# Altium project Remote_Control.PrjPcb
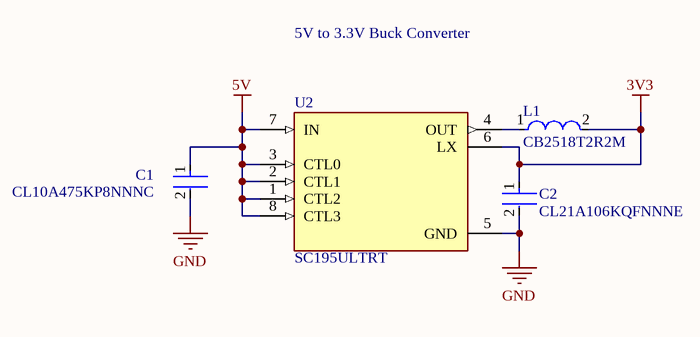
[diagram p0: Power.SchDoc]
3 sheets, 25 parts. Net scope: global (net labels, ports and power ports of the same name join across sheets).
Board file: MainBoard.PcbDoc
Sheets:
  Power.SchDoc
  USB.SchDoc
  Microcontroller.SchDoc

## Sheet Power.SchDoc
size A; SheetNumber: 1; SheetTotal: 3

### Parts
C1  CL10A475KP8NNNC  [FP-CL10-IPC_C]
C2  CL21A106KQFNNNE  [FP-CL21-IPC_A]
L1  CB2518T2R2M  [FP-CB2518-IPC_C]
U2  SC195ULTRT  [QFN40P150X150X60-8N]

### Nets
3V3: C2.1 L1.2 U2.6(LX)
5V: C1.1 U2.1(CTL2) U2.2(CTL1) U2.3(CTL0) U2.7(IN) U2.8(CTL3)
GND: C1.2 C2.2 U2.5(GND)
NetL1_1: L1.1 U2.4(OUT)

### Notes on the sheet
- 5V to 3.3V Buck Converter

### Library data of the parts
C1 = CMP-13271-003017-1: Cap Ceramic 4.7uF 10V X5R ±10% Pad SMD 0603 +85°C T/R; Capacitance: 4.7uF; Case/Package: 0603; Packaging: Tape and Reel; Width: 0.031inch; Contact Plating: Tin; Thickness: 0.035inch; Package Quantity: 1; Voltage Rating: 10V; Case Code (Metric): 1608; Case Code (Imperial): 0603; Depth: 0.8mm; Height: 0.8mm; Tolerance: 10%; Max Operating Temperature: 85°C; Length: 1.6mm; Dielectric: X5R; Mount: Surface Mount; Radiation Hardening: No; Min Operating Temperature: -55°C
C2 = CMP-13271-001826-1: CL21 Series 0805 10uF 6.3V ±10% Tolerance X5R Multilayer Ceramic Chip Capacitor; Voltage Rating (DC): 6.3V; Thickness: 0.053inch; Min Operating Temperature: -55°C; Mount: Surface Mount; Max Operating Temperature: 85°C; Case Code (Metric): 2012; Dielectric: X5R; Length: 2mm; Case Code (Imperial): 0805; Radiation Hardening: No; Height: 1.25mm; Depth: 1.25mm; Contact Plating: Tin; Voltage Rating: 6.3V; Width: 0.049inch; Package Quantity: 1; Capacitance: 10uF; Packaging: Tape and Reel; Tolerance: 10%; Lead Free: Lead Free; Case/Package: 0805
L1 = CMP-14484-000089-1: SMD Inductors 2.2uH ±20% 1.3A 0.117Ω 1007; Self Resonant Frequency: 68MHz; DC Resistance (DCR): 117mR; Core Material: Ferrite; Saturation Current: 510mA; Test Frequency: 7.96MHz; Shielding: Unshielded; Width: 0.071inch; Max Operating Temperature: 105°C; Tolerance: 20%; Halogen Free: Halogen Free; Length: 0.098inch; Height: 1.8mm; Case Code (Imperial): 1007; Package Quantity: 2000; Inductance: 2.2uH; Case/Package: 1007; Case Code (Metric): 2518; Current Rating: 1.3A; Packaging: Tape and Reel; Depth: 2mm; Mount: Surface Mount; Number of Pins: 2; Series: CB; Radiation Hardening: No; Height - Seated (Max): 0.079inch; Lead Free: Lead Free; Min Operating Temperature: -40°C; Termination: SMD/SMT; Resistor Type: Wirewound; Max DC Current: 510mA
U2 = SC195ULTRT: Buck Switching Regulator IC Positive Programmable 0.8V 1 Output 500mA 8-UFQFN; MF: {'manufacturer': u'Semtech Corporation'}; Value: *; Package: None; MP: SC195ULTRT; Price: None; Availability: Unavailable

## Sheet USB.SchDoc
size A; SheetNumber: 2; SheetTotal: 3
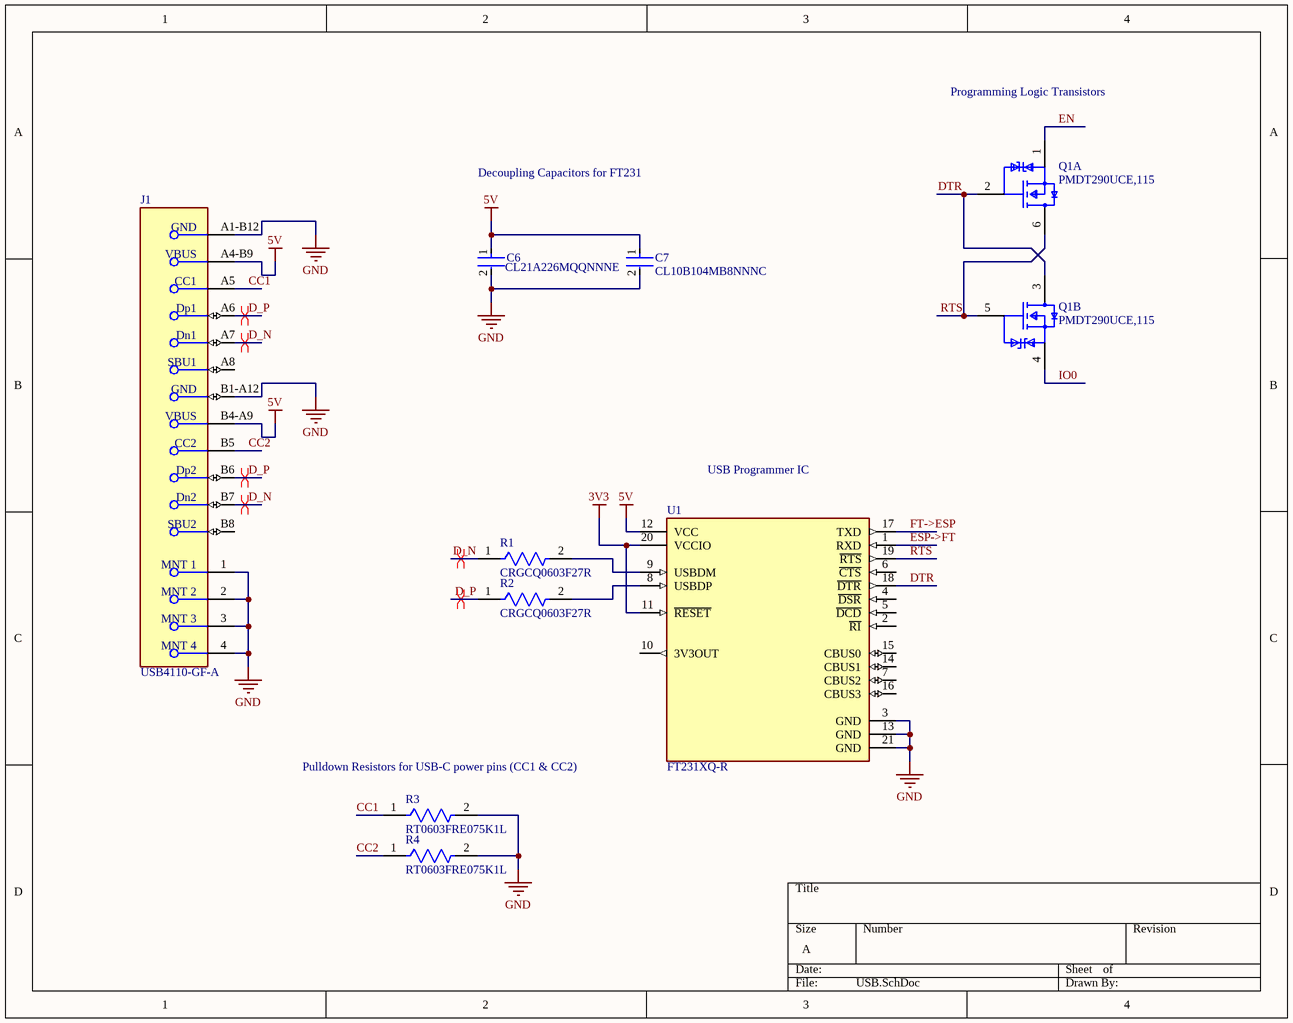
[diagram p1: USB.SchDoc]

### Parts
C6  CL21A226MQQNNNE  [FP-CL21-IPC_A]
C7  CL10B104MB8NNNC  [FP-CL10-IPC_C]
J1  USB4110-GF-A  [FP-USB4110-GF-A-MFG]
Q1  PMDT290UCE,115  [FP-SOT666-MFG]  (parts A,B of 2)
R1  CRGCQ0603F27R  [FP-CRGCQ0603-IPC_C]
R2  CRGCQ0603F27R  [FP-CRGCQ0603-IPC_C]
R3  RT0603FRE075K1L  [FP-RT0603-MFG]
R4  RT0603FRE075K1L  [FP-RT0603-MFG]
U1  FT231XQ-R  [FP-QFN-20-MFG]

### Nets
3V3: U1.11(~{RESET}) U1.20(VCCIO)
5V: C6.1 C7.1 J1.A4-B9(VBUS) J1.B4-A9(VBUS) U1.12(VCC)
GND: C6.2 C7.2 J1.1(MNT_1) J1.2(MNT_2) J1.3(MNT_3) J1.4(MNT_4) J1.A1-B12(GND) J1.B1-A12(GND) R3.2 R4.2 U1.3(GND) U1.13(GND) U1.21(GND)
CC1: J1.A5(CC1) R3.1
CC2: J1.B5(CC2) R4.1
D_N: J1.A7(Dn1) J1.B7(Dn2) R1.1
D_P: J1.A6(Dp1) J1.B6(Dp2) R2.1
DTR: Q1.2(G1) Q1.3(D2) U1.18(~{DTR})
EN: Q1.1(S1)
ESP->FT: U1.1(RXD)
FT->ESP: U1.17(TXD)
IO0: Q1.4(S2)
RTS: Q1.5(G2) Q1.6(D1) U1.19(~{RTS})
NetR1_2: R1.2 U1.9(USBDM)
NetR2_2: R2.2 U1.8(USBDP)

Not connected (* = marked no-connect by the designer): J1 A8(SBU1) B8(SBU2); U1 2(~{RI}) 4(~{DSR}) 5(~{DCD}) 6(~{CTS}) 7(CBUS2) 10(3V3OUT) 14(CBUS1) 15(CBUS0) 16(CBUS3)

### Layout directives
differential pair: D_N, D_P

### Notes on the sheet
- Programming Logic Transistors
- Decoupling Capacitors for FT231
- USB Programmer IC
- Pulldown Resistors for USB-C power pins (CC1 & CC2)

### Library data of the parts
C6 = CMP-13271-000185-1: CL21 Series 0805 22uF 6.3V ±20% Tolerance X5R Multilayer Ceramic Chip Capacitor; Height: 1.25mm; Length: 2mm; Capacitance: 22uF; Mount: Surface Mount; Dielectric: X5R; Voltage Rating (DC): 6.3V; Case Code (Metric): 2012; Depth: 1.25mm; Max Operating Temperature: 85°C; Voltage Rating: 6.3V; Width: 0.049inch; Case/Package: 0805; Radiation Hardening: No; Thickness: 0.055inch; Packaging: Tape and Reel; Package Quantity: 2000; Lead Free: Lead Free; Contact Plating: Tin; Min Operating Temperature: -55°C; Case Code (Imperial): 0805; Tolerance: 20%
C7 = CMP-13271-001724-1: Cap Ceramic 100nF 50V X7R ±20% Pad SMD 0603 +125°C T/R; Mount: Surface Mount; Lead Free: Lead Free; Max Operating Temperature: 125°C; Voltage Rating: 50V; Case Code (Imperial): 0603; Capacitance: 100nF; Height: 0.8mm; Length: 1.6mm; Tolerance: 20%; Case Code (Metric): 1608; Thickness: 0.035inch; Depth: 0.8mm; Width: 0.031inch; Package Quantity: 1; Min Operating Temperature: -55°C; Case/Package: 0603; Radiation Hardening: No; Voltage Rating (DC): 50V; Dielectric: X7R; Packaging: Tape and Reel
J1 = CMP-245163-000002-1: CONN USB 2.0 TYPE-C R/A SMT; Manufacturer: GCT; Conn Orientation: Right Angle; Usb Standard: USB 2.0; Voltage Rating: 20V; Current Rating: 3/4.25/1.25/0.25A; Number Of Contacts: 16; Is Female: yes; Shielding: true; Standoff Height: 0.1mm; Octopart: https://octopart.com/usb4110-gf-a-gct-103941985; Temperature: -40°C to +85°C; RoHS: TRUE; Automotive: No; Contact Material: Gold,Nickel; Device Class L1: Connectors; Device Class L2: USB Connectors; Package: 0; Lead Free: Yes; ComponentLink2URL: https://gct.co/files/drawings/usb4110.pdf; Temperature Range High: +85°C; Temperature Range Low: -40°C; Height: 3.46mm; Manufacturer Part Number: USB4110-GF-A; ComponentLink2Description: Datasheet; Device Class L3: unset; Digikey Description: CONN USB 2.0 TYPE-C R/A SMT; Category: Conn
Q1 = CMP-14409-000021-1: MOSFET N/P-CH 20V SOT666
R1 R2 = CMP-03211-005286-1: CRGCQ 0603 27R 1%; Manufacturer: TE Connectivity; Value: 27Ω; Power Rating: 0.1W; Voltage Rating: 75V; Tolerance: 0.01; Temperature Coefficient: ±200ppm/°C; ComponentLink2URL: https://www.te.com/commerce/DocumentDelivery/DDEController?Action=showdoc&DocId=Data+Sheet%7F1773204-3%7F1%7Fpdf%7FEnglish%7FENG_DS_1773204-3_1.pdf%7F4-2176339-332; ComponentLink2Description: Datasheet; Height: 0.55mm; Composition: Thick Film; Device Class L3: Chip SMD Resistors; Ambient Temperature Range High: +70°C; Device Class L2: Resistors; Package: CRGCQ0603; Digikey Description: CRGCQ 0603 27R 1%; Resistance: 27Ω; RoHS: TRUE; Temperature: -55°C to +155°C; Series: CRGCQ; Manufacturer Part Number: CRGCQ0603F27R; Category: Res; Device Class L1: Passive Components; Octopart: https://octopart.com/crgcq0603f27r-te+connectivity-91018062; Temperature Range High: +155°C; Lead Free: Yes; Ipc Land Pattern Name: RESC16080X45; Temperature Range Low: -55°C
R3 R4 = CMP-2000-04778-2: RES SMD 5.1K OHM 1% 1/10W 0603; Manufacturer: Yageo; Value: 5.1KΩ; Temperature Coefficient: 50 ppm/°C; Power Rating: 0.1W; Voltage Rating: 75V; Tolerance: 0.01; Lead Free: Yes; Temperature Range High: +155°C; Package: RT0603; Resistance: 5.1KΩ; Series: RT; Footprint Url: http://www.yageo.com/exep/pages/download/literatures/PYu-R_Mount_10.pdf; Ipc Land Pattern Name: RESC16080X45; Mouser Description: Res Thin Film 0603 5.1K Ohm 1% 0.1W(1/10W) ±50ppm/C Epoxy Pad SMD T/R; Octopart: https://octopart.com/rt0603fre075k1l-yageo-1421390; ComponentLink2URL: http://www.yageo.com/documents/recent/PYu-RT_1-to-0.01_RoHS_L_9.pdf; Manufacturer Part Number: RT0603FRE075K1L; RoHS: TRUE; Device Class L3: Chip SMD Resistors; Digikey Description: RES SMD 5.1K OHM 1% 1/10W 0603; Temperature: -55°C to +155°C; Height: 0.55mm; Automotive: No; Device Class L1: Passive Components; Temperature Range Low: -55°C; Category: Res; Composition: Thin Film; ComponentLink2Description: Datasheet; Device Class L2: Resistors
U1 = CMP-0248-00001-3: IC USB SERIAL FULL UART 20QFN; Data Rate: 12Mbps; Operating Supply Current: 8mA; Min Supply Voltage: 2.97V; Max Supply Voltage: 5.5V; Number of Channels: 1; Min Operating Temperature: -40°C; Case/Package: QFN; Mount: Surface Mount; Number of Pins: 20; Interface: UART; Lead Free: Lead Free; Package Quantity: 5000; Weight: 0.004339oz; Packaging: Tape and Reel; Max Operating Temperature: 85°C

## Sheet Microcontroller.SchDoc
size A; SheetNumber: 3; SheetTotal: 3
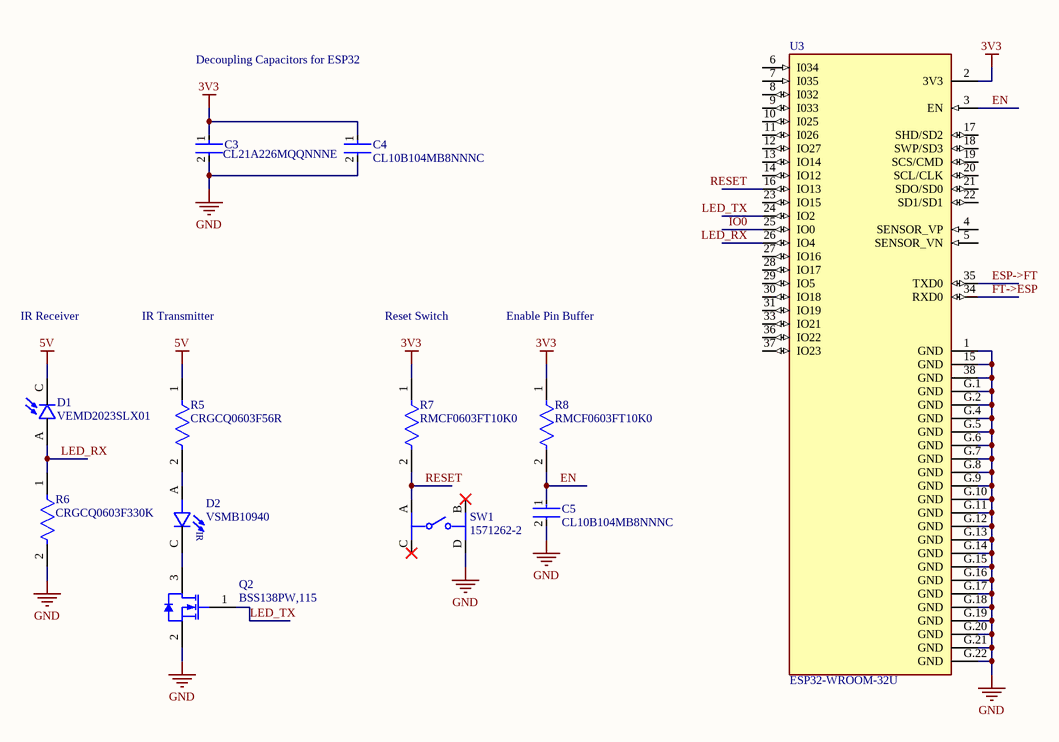
[diagram p2: Microcontroller.SchDoc]

### Parts
C3  CL21A226MQQNNNE  [FP-CL21-IPC_A]
C4  CL10B104MB8NNNC  [FP-CL10-IPC_C]
C5  CL10B104MB8NNNC  [FP-CL10-IPC_C]
D1  VEMD2023SLX01  [XDCR_VEMD2023SLX01]
D2  VSMB10940  [DIO_VSMB10940]
Q2  BSS138PW,115  [NXP-SOT323_M]
R5  CRGCQ0603F56R  [FP-CRGCQ0603-IPC_C]
R6  CRGCQ0603F330K  [FP-CRGCQ0603-IPC_C]
R7  RMCF0603FT10K0  [FP-RMCF0603-MFG]
R8  RMCF0603FT10K0  [FP-RMCF0603-MFG]
SW1  1571262-2  [FP-1571262-2-MFG]
U3  ESP32-WROOM-32U  [XCVR_ESP32-WROOM-32U]

### Nets
3V3: C3.1 C4.1 R7.1 R8.1 U3.2(3V3)
5V: D1.C R5.1
GND: C3.2 C4.2 C5.2 Q2.2(S) R6.2 SW1.D U3.1(GND) U3.15(GND) U3.38(GND) U3.G.1(GND) U3.G.2(GND) U3.G.4(GND) U3.G.5(GND) U3.G.6(GND) U3.G.7(GND) U3.G.8(GND) U3.G.9(GND) U3.G.10(GND) U3.G.11(GND) U3.G.12(GND) U3.G.13(GND) U3.G.14(GND) U3.G.15(GND) U3.G.16(GND) U3.G.17(GND) U3.G.18(GND) U3.G.19(GND) U3.G.20(GND) U3.G.21(GND) U3.G.22(GND)
EN: C5.1 R8.2 U3.3(EN)
ESP->FT: U3.35(TXD0)
FT->ESP: U3.34(RXD0)
IO0: U3.25(IO0)
LED_RX: D1.A R6.1 U3.26(IO4)
LED_TX: Q2.1(G) U3.24(IO2)
RESET: R7.2 SW1.A U3.16(IO13)
NetD2_A: D2.A R5.2
NetD2_C: D2.C Q2.3(D)

Not connected (* = marked no-connect by the designer): SW1 B* C*; U3 4(SENSOR_VP) 5(SENSOR_VN) 6(I034) 7(I035) 8(I032) 9(I033) 10(I025) 11(I026) 12(IO27) 13(IO14) 14(IO12) 17(SHD/SD2) 18(SWP/SD3) 19(SCS/CMD) 20(SCL/CLK) 21(SDO/SD0) 22(SD1/SD1) 23(IO15) 27(IO16) 28(IO17) 29(IO5) 30(IO18) 31(IO19) 33(IO21) 36(IO22) 37(IO23)

### Notes on the sheet
- Decoupling Capacitors for ESP32
- IR Receiver
- IR Transmitter
- Reset Switch
- Enable Pin Buffer
- (in symbol VSMB10940) IR

### Library data of the parts
C3 = CMP-13271-000185-1: as C6 on sheet USB; Height: 1.25mm; Length: 2mm; Capacitance: 22uF; Mount: Surface Mount; Dielectric: X5R; Voltage Rating (DC): 6.3V; Case Code (Metric): 2012; Depth: 1.25mm; Max Operating Temperature: 85°C; Voltage Rating: 6.3V; Width: 0.049inch; Case/Package: 0805; Radiation Hardening: No; Thickness: 0.055inch; Packaging: Tape and Reel; Package Quantity: 2000; Lead Free: Lead Free; Contact Plating: Tin; Min Operating Temperature: -55°C; Case Code (Imperial): 0805; Tolerance: 20%
C4 C5 = CMP-13271-001724-1: as C7 on sheet USB; Mount: Surface Mount; Lead Free: Lead Free; Max Operating Temperature: 125°C; Voltage Rating: 50V; Case Code (Imperial): 0603; Capacitance: 100nF; Height: 0.8mm; Length: 1.6mm; Tolerance: 20%; Case Code (Metric): 1608; Thickness: 0.035inch; Depth: 0.8mm; Width: 0.031inch; Package Quantity: 1; Min Operating Temperature: -55°C; Case/Package: 0603; Radiation Hardening: No; Voltage Rating (DC): 50V; Dielectric: X7R; Packaging: Tape and Reel
D1 = VEMD2023SLX01: MF: {'manufacturer': u'Vishay Semiconductor'}; Value: *; Package: None; MP: VEMD2023SLX01; Price: None; Availability: Unavailable
D2 = VSMB10940: 940 nm 65 mA Â±75Â° Surface Mount High Speed Infrared Emitting Diode; MF: {'manufacturer': u'Vishay Semiconductor'}; Value: *; Package: None; MP: VSMB10940; Price: None; Availability: Unavailable
Q2 = CMP-1259-00109-1: N-Channel Trench MOSFET, 60 V, 0.32 A, -55 to 150 degC, 3-Pin SOT323, Tape and Reel; Manufacturer: NXP Semiconductors; IDM [max] (A): 1.2; ID [max] (A): 0.32; Automotive Qualified: Y; Channel Type: N; VDS [max] (V): 60; Packing: Tape & Reel; DatasheetVersion: Rev. 1; PartNumber: BSS138PW,115; ComponentLink2URL: http://www.nxp.com/documents/data_sheet/BSS138PW.pdf; ComponentLink3Description: Package Specification; PackageReference: SOT323; PackageDescription: 3-Pin Small Outline Transistor Package, Body 2 x 1.25 mm, Pitch 0.65 mm; Code_JEITA: SC-70; ComponentLink3URL: http://www.nxp.com/documents/outline_drawing/sot323_po.pdf; ComponentLink1URL: http://www.nxp.com/; ComponentLink2Description: Datasheet; PackageVersion: 06-03-16, 03/2006; Mounting Technology: Surface Mount; ComponentLink1Description: Manufacturer URL; VGSth [typ] (V): 1.2
R5 = CMP-03211-009681-1: CRGCQ0603 56Ω 1% ±200ppm/°C 75V; Manufacturer: TE Connectivity; Tolerance: 0.01; Power Rating: 0.1W; Temperature Coefficient: ±200ppm/°C; Package: CRGCQ0603; Value: 56Ω; Temperature Range Low: -55°C; Composition: Thick Film; Series: CRGCQ; ComponentLink2Description: Datasheet; ComponentLink2URL: https://www.te.com/commerce/DocumentDelivery/DDEController?Action=showdoc&DocId=Data+Sheet%7F1773204-3%7F1%7Fpdf%7FEnglish%7FENG_DS_1773204-3_1.pdf%7F4-2176339-408; Category: Res; Temperature Range High: +155°C; Octopart: https://octopart.com/crgcq0603f56r-te+connectivity-91018083; RoHS: TRUE; Height: 0.55mm; Lead Free: Yes; Resistance: 56Ω; Device Class L3: Chip SMD Resistors; Ipc Land Pattern Name: RESC16080X45; Ambient Temperature Range High: +70°C; Device Class L1: Passive Components; Device Class L2: Resistors; Temperature: -55°C to +155°C; Voltage Rating: 75V; Manufacturer Part Number: CRGCQ0603F56R
R6 = CMP-03211-011074-1: Res Thick Film 0603 330K Ohm 1% 0.1W(1/10W) ±100ppm/C Pad SMD Automotive T/R; Manufacturer: TE Connectivity; Temperature Coefficient: ±100ppm/°C; Tolerance: 0.01; Value: 330KΩ; Voltage Rating: 75V; Temperature Range Low: -55°C; ComponentLink2Description: Datasheet; Ambient Temperature Range High: +70°C; Composition: Thick Film; ComponentLink2URL: https://www.te.com/commerce/DocumentDelivery/DDEController?Action=showdoc&DocId=Data+Sheet%7F1773204-3%7F1%7Fpdf%7FEnglish%7FENG_DS_1773204-3_1.pdf%7F4-2176339-1264; Octopart: https://octopart.com/crgcq0603f330k-te+connectivity-91018065; Category: Res; RoHS: TRUE; Manufacturer Part Number: CRGCQ0603F330K; Device Class L2: Resistors; Resistance: 330KΩ; Digikey Description: Res Thick Film 0603 330K Ohm 1% 0.1W(1/10W) ±100ppm/C Pad SMD Automotive T/R; Height: 0.55mm; Ipc Land Pattern Name: RESC16080X45; Power Rating: 0.1W; Temperature: -55°C to +155°C; Series: CRGCQ; Package: CRGCQ0603; Temperature Range High: +155°C; Device Class L3: Chip SMD Resistors; Lead Free: Yes; Device Class L1: Passive Components
R7 R8 = CMP-2000-06990-2: 10kΩ ±1% 0.1W 0603 Thick Film Chip Resistor AEC-Q200 compliant; Max Power Dissipation: 100mW; Resistance: 10kR; Temperature Coefficient: 100ppm/°C; Military Standard: Not; Mount: Surface Mount; Depth: 0.8mm; Height: 0.022inch; Size Code: 0603; Case/Package: 0603; Resistor Type: Thick Film; Min Operating Temperature: -55°C; Length: 1.55mm; Construction: Rectangular; Case Code (Imperial): 0603; Packaging: Tape and Reel; Radiation Hardening: No; Power Rating: 100mW; Max Operating Temperature: 155°C; Contact Plating: Tin; Case Code (Metric): 1608; Lead Free: Lead Free; Series: RMCF; Tolerance: 1%; Features: Automotive AEC-Q200; Number of Terminations: 2; RoHS Compliant: Yes; Width: 0.031inch
SW1 = CMP-03402-000034-1: SWITCH TACTILE SPST-NO 0.05A 12V; Max Current Rating: 50mA; Illumination Type: Non-Illuminated; Mechanical Life: 50000Cycles; Throw Configuration: SPST; Operating Force: 1.6N; Switch Function: Off-Mom; Actuator Color: Black; Actuator Length: 0.055inch; Actuator Material: Liquid Crystal Polymer; Mount: Surface Mount; RoHS Compliant: Yes; Case/Package: SMD/SMT; Termination: Gull Wing; Voltage Rating (DC): 12V; Radiation Hardening: No; Package Quantity: 1; Min Operating Temperature: -20°C; Contact Material: Stainless Steel; Type: Switch; Contact Current Rating: 50mA; Material: Nylon; Current Rating: 50mA; Orientation: Right Angle; ELV: Compliant; Housing Material: Nylon; Depth: 7.15mm; Contact Plating: Silver; Max Operating Temperature: 85°C; Packaging: Tape and Reel; Length: 5.4mm; Max Voltage Rating (DC): 12V; Series: Alcoswitch
U3 = ESP32-WROOM-32U: Wi-Fi/BT BLE Module ESP32-D0WD SPI Flash UART U.FL Conn.; MF: {'manufacturer': u'Espressif Systems'}; Value: *; Package: None; MP: ESP32-WROOM-32U; Price: None; Availability: Unavailable

## Nets that join several sheets
3V3: Power (C2.1 L1.2 U2.6), USB (U1.11 U1.20), Microcontroller (5 pins)
5V: Power (6 pins), USB (5 pins), Microcontroller (D1.C R5.1)
GND: Power (C1.2 C2.2 U2.5), USB (13 pins), Microcontroller (30 pins)
EN: USB (Q1.1), Microcontroller (C5.1 R8.2 U3.3)
ESP->FT: USB (U1.1), Microcontroller (U3.35)
FT->ESP: USB (U1.17), Microcontroller (U3.34)
IO0: USB (Q1.4), Microcontroller (U3.25)